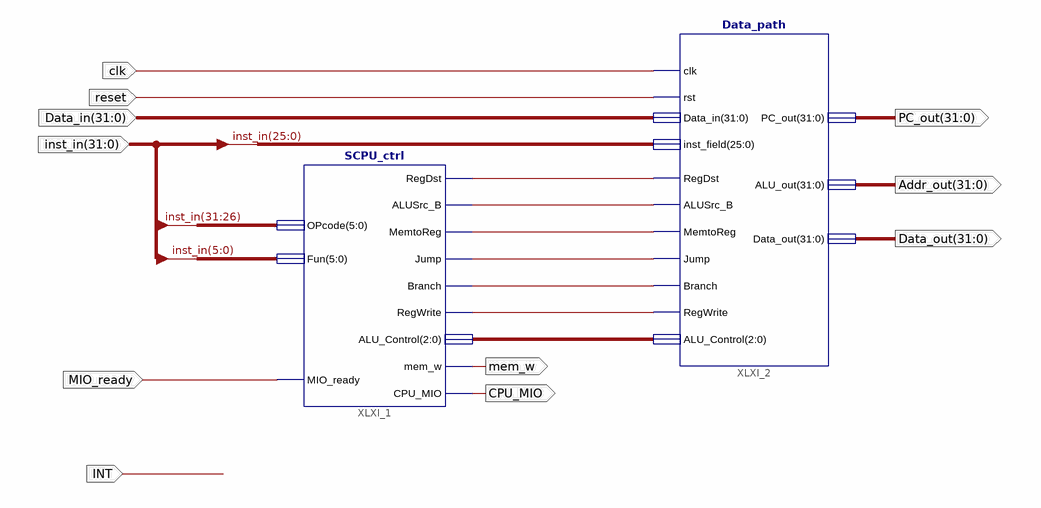
[diagram p0: schematic sheet 1]
// Xilinx ISE schematic SCPU.sch (kintex7) as structural Verilog: 2 symbols, 11 ports
module SCPU (
  input  clk,
  input  reset,
  input  [31:0] Data_in,
  input  MIO_ready,
  input  INT,
  input  [31:0] inst_in,
  output [31:0] PC_out,
  output [31:0] Addr_out,
  output [31:0] Data_out,
  output mem_w,
  output CPU_MIO
);

  wire XLXN_11, XLXN_12, XLXN_13, XLXN_14, XLXN_16, XLXN_27;
  wire [2:0] XLXN_10;

  Data_path XLXI_2 (
    .RegDst(XLXN_16), .ALUSrc_B(XLXN_27), .MemtoReg(XLXN_14), .Jump(XLXN_13), .Branch(XLXN_12),
    .RegWrite(XLXN_11), .ALU_Control(XLXN_10), .Data_in(Data_in), .inst_field(inst_in[25:0]), .clk(clk),
    .rst(reset), .PC_out(PC_out), .ALU_out(Addr_out), .Data_out(Data_out));
  SCPU_ctrl XLXI_1 (
    .RegDst(XLXN_16), .ALUSrc_B(XLXN_27), .MemtoReg(XLXN_14), .Jump(XLXN_13), .Branch(XLXN_12),
    .RegWrite(XLXN_11), .ALU_Control(XLXN_10), .CPU_MIO(CPU_MIO), .mem_w(mem_w), .Fun(inst_in[5:0]),
    .MIO_ready(MIO_ready), .OPcode(inst_in[31:26]));
endmodule
